# EAGLE design ESPExtra-0.1.1 (EAGLE 7.7.0)
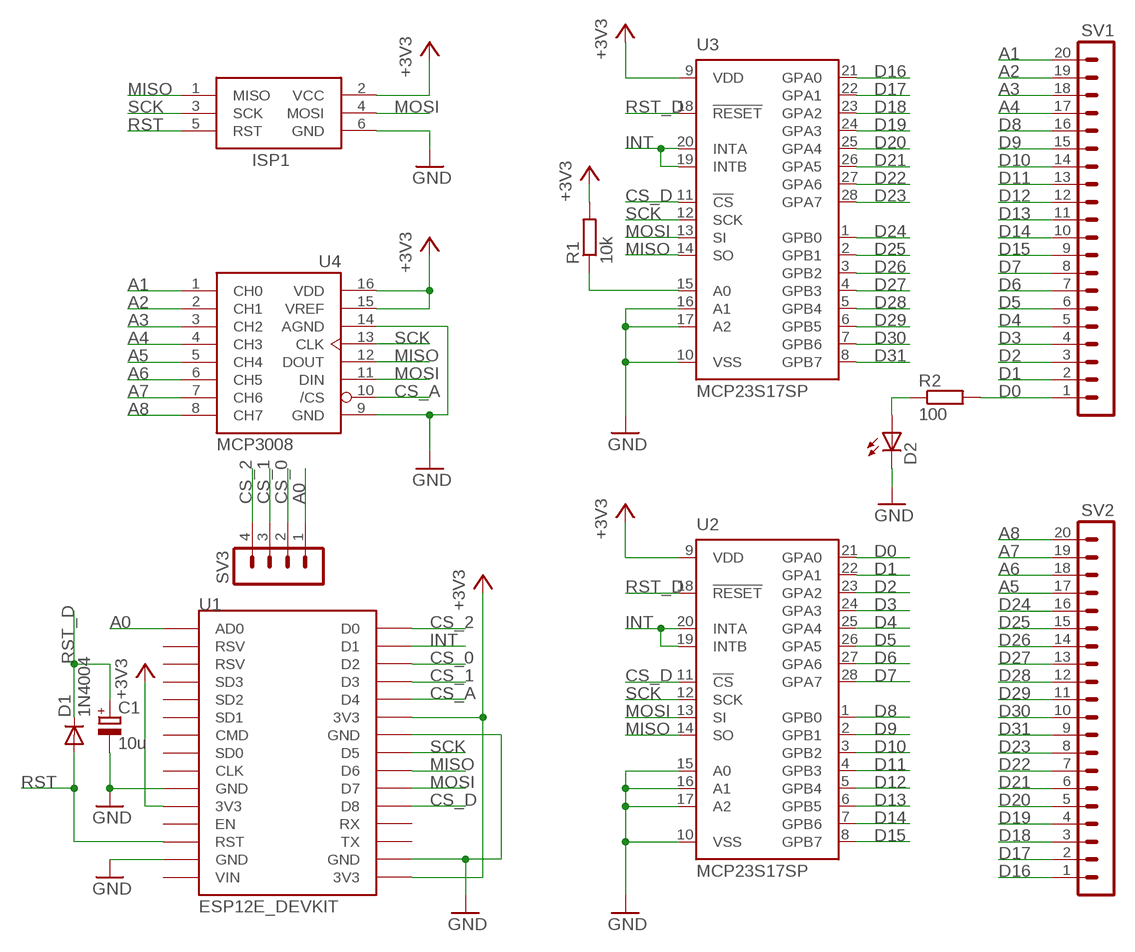
[diagram p0: schematic, sheet 1]

## Parts
C1  10u  CPOL-EUE2.5-5  [E2,5-5]
D1  1N4004  [DO41-10]
D2  LED3MM  [LED3MM]
ISP1  AVRISP-6  [AVRISP]
R1  10k  R-EU_0204/5  [0204/5]
R2  100  R-EU_0204/5  [0204/5]
SV1  MA20-1  [MA20-1]
SV2  MA20-1  [MA20-1]
SV3  MA04-1  [MA04-1]
U1  ESP12E_DEVKIT  [ESP12E_DEVKIT]
U2  MCP23S17SP  [DIL28-3]
U3  MCP23S17SP  [DIL28-3]
U4  MCP3008  [DIL16]

## Nets
+3V3: ISP1.2(VCC) R1.2 U1.3V3@0(3V3) U1.3V3@1(3V3) U1.3V3@2(3V3) U2.9(VDD) U3.9(VDD) U4.15(VREF) U4.16(VDD)
A0: SV3.1 U1.AD0
A1: SV1.20 U4.1(CH0)
A2: SV1.19 U4.2(CH1)
A3: SV1.18 U4.3(CH2)
A4: SV1.17 U4.4(CH3)
A5: SV2.17 U4.5(CH4)
A6: SV2.18 U4.6(CH5)
A7: SV2.19 U4.7(CH6)
A8: SV2.20 U4.8(CH7)
CS_0: SV3.2 U1.D2
CS_1: SV3.3 U1.D3
CS_2: SV3.4 U1.D0
CS_A: U1.D4 U4.10(/CS)
CS_D: U1.D8 U2.11(!CS) U3.11(!CS)
D0: R2.2 SV1.1 U2.21(GPA0)
D1: SV1.2 U2.22(GPA1)
D2: SV1.3 U2.23(GPA2)
D3: SV1.4 U2.24(GPA3)
D4: SV1.5 U2.25(GPA4)
D5: SV1.6 U2.26(GPA5)
D6: SV1.7 U2.27(GPA6)
D7: SV1.8 U2.28(GPA7)
D8: SV1.16 U2.1(GPB0)
D9: SV1.15 U2.2(GPB1)
D10: SV1.14 U2.3(GPB2)
D11: SV1.13 U2.4(GPB3)
D12: SV1.12 U2.5(GPB4)
D13: SV1.11 U2.6(GPB5)
D14: SV1.10 U2.7(GPB6)
D15: SV1.9 U2.8(GPB7)
D16: SV2.1 U3.21(GPA0)
D17: SV2.2 U3.22(GPA1)
D18: SV2.3 U3.23(GPA2)
D19: SV2.4 U3.24(GPA3)
D20: SV2.5 U3.25(GPA4)
D21: SV2.6 U3.26(GPA5)
D22: SV2.7 U3.27(GPA6)
D23: SV2.8 U3.28(GPA7)
D24: SV2.16 U3.1(GPB0)
D25: SV2.15 U3.2(GPB1)
D26: SV2.14 U3.3(GPB2)
D27: SV2.13 U3.4(GPB3)
D28: SV2.12 U3.5(GPB4)
D29: SV2.11 U3.6(GPB5)
D30: SV2.10 U3.7(GPB6)
D31: SV2.9 U3.8(GPB7)
GND: C1.- D2.K(C) ISP1.6(GND) U1.GND@0(GND) U1.GND@1(GND) U1.GND@2(GND) U1.GND@3(GND) U2.10(VSS) U2.15(A0) U2.16(A1) U2.17(A2) U3.10(VSS) U3.16(A1) U3.17(A2) U4.9(GND) U4.14(AGND)
INT: U1.D1 U2.19(INTB) U2.20(INTA) U3.19(INTB) U3.20(INTA)
MISO: ISP1.1(MISO) U1.D6 U2.14(SO) U3.14(SO) U4.12(DOUT)
MOSI: ISP1.4(MOSI) U1.D7 U2.13(SI) U3.13(SI) U4.11(DIN)
N$1: D2.A R2.1
N$25: R1.1 U3.15(A0)
RST: D1.A ISP1.5(RST) U1.RST
RST_D: C1.+ D1.C U2.18(!RESET) U3.18(!RESET)
SCK: ISP1.3(SCK) U1.D5 U2.12(SCK) U3.12(SCK) U4.13(CLK)
Unconnected: U1.CLK U1.CMD U1.EN U1.RSV@0(RSV) U1.RSV@1(RSV) U1.RX U1.SD0 U1.SD1 U1.SD2 U1.SD3 U1.TX U1.VIN

## Library data of the parts
C1 = resistor:CPOL-EU: POLARIZED CAPACITOR, European symbol
D1 = diode:1N4004: DIODE general purpose rectifier, 1 A
D2 = led:LED: LED OSRAM: - CHIPLED LG R971, LG N971, LY N971, LG Q971, LY Q971, LO R971, LY R971 LH N974, LH R974 LS Q976, LO Q976, LY Q976 LO Q996 - Hyper CHIPLED LW Q18S LB Q993, LB Q99A, LB R99A - SideLED LS A670, LO A670, LY A670, LG A670, LP A670 LB A673, LV A673, LT A673, LW A673 LH A674 LY A675 LS A676, LA A676, LO A676, LY A676, LW A676 LS A679, LY A679, LG A679 - Hyper Micro SIDELED® LS Y876, LA Y876, LO Y876, LY Y876 LT Y87S - SmartLED LW L88C, LW L88S LB L89C, LB L89S, LG L890 LS L89K, LO L89K, LY L89K LS L896, LA L896, LO L896, LY L896 - TOPLED LS T670, LO T670, LY T670, LG T670, LP T670 LSG T670, LSP T670, LSY T670, LOP T670, LYG T670 LG T671, LOG T671, LSG T671 LB T673, LV T673, LT T673, LW T673 LH T674 LS T676, LA T676, LO T676, LY T676, LB T676, LH T676, LSB T676, LW T676 LB T67C, LV T67C, LT T67C, LS T67K, LO T67K, LY T67K, LW E67C LS E67B, LA E67B, LO E67B, LY E67B, LB E67C, LV E67C, LT E67C LW T67C LS T679, LY T679, LG T679 LS T770, LO T770, LY T770, LG T770, LP T770 LB T773, LV T773, LT T773, LW T773 LH T774 LS E675, LA E675, LY E675, LS T675 LS T776, LA T776, LO T776, LY T776, LB T776 LHGB T686 LT T68C, LB T68C - Hyper Mini TOPLED® LB M676 - Mini TOPLED Santana® LG M470 LS M47K, LO M47K, LY M47K Source: http://www.osram.convergy.de LUXEON: - LUMILED® LXK2-PW12-R00, LXK2-PW12-S00, LXK2-PW14-U00, LXK2-PW14-V00 LXK2-PM12-R00, LXK2-PM12-S00, LXK2-PM14-U00 LXK2-PE12-Q00, LXK2-PE12-R00, LXK2-PE12-S00, LXK2-PE14-T00, LXK2-PE14-U00 LXK2-PB12-K00, LXK2-PB12-L00, LXK2-PB12-M00, LXK2-PB14-N00, LXK2-PB14-P00, LXK2-PB14-Q00 LXK2-PR12-L00, LXK2-PR12-M00, LXK2-PR14-Q00, LXK2-PR14-R00 LXK2-PD12-Q00, LXK2-PD12-R00, LXK2-PD12-S00 LXK2-PH12-R00, LXK2-PH12-S00 LXK2-PL12-P00, LXK2-PL12-Q00, LXK2-PL12-R00 Source: www.luxeon.com KINGBRIGHT: KA-3528ASYC Source: www.kingbright.com
ISP1 = adafruit:AVRISP: AVR ISP HEADER Standard 6 pin header for AVR programming
R1 R2 = resistor:R-EU_: RESISTOR, European symbol
SV1 SV2 = con-lstb:MA20-1: PIN HEADER; OC_FARNELL: unknown; OC_NEWARK: unknown
SV3 = con-lstb:MA04-1: PIN HEADER; OC_FARNELL: unknown; OC_NEWARK: unknown
U1 = ESP12E_DEVKIT:ESP12E_DEVKIT: ESP12E DEVKIT BOARD
U2 U3 = microchip:MCP23S17: http://ww1.microchip.com/downloads/en/DeviceDoc/21952a.pdf Source: http://ww1.microchip.com/downloads/en/DeviceDoc/21952a.pdf; MF: MICROCHIP; MPN: MCP23S17-E/SP; OC_FARNELL: 1292238; OC_NEWARK: 31K2951
U4 = adafruit:MCP3008

## Board
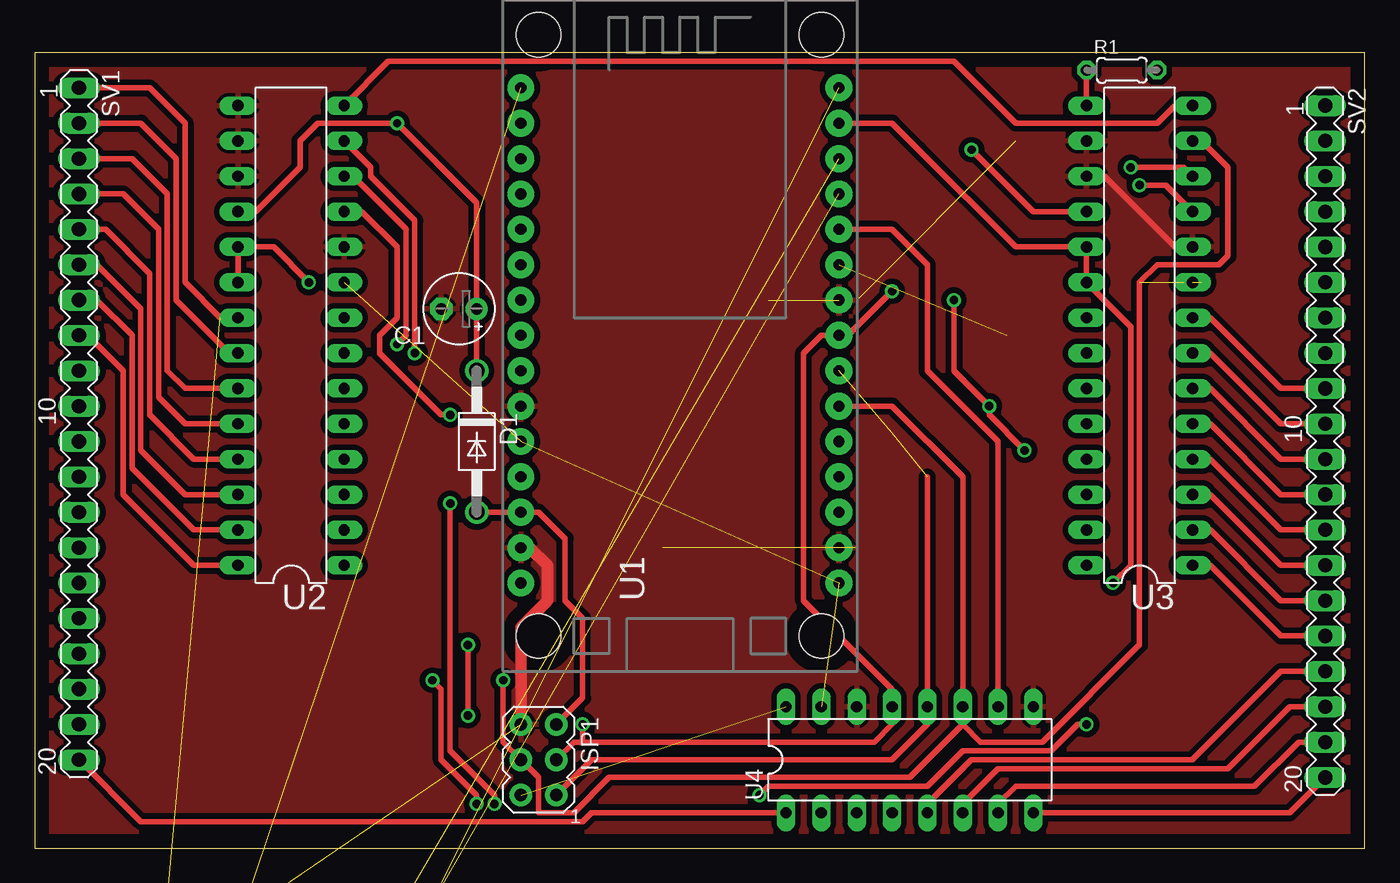
[diagram p1: board, top side]
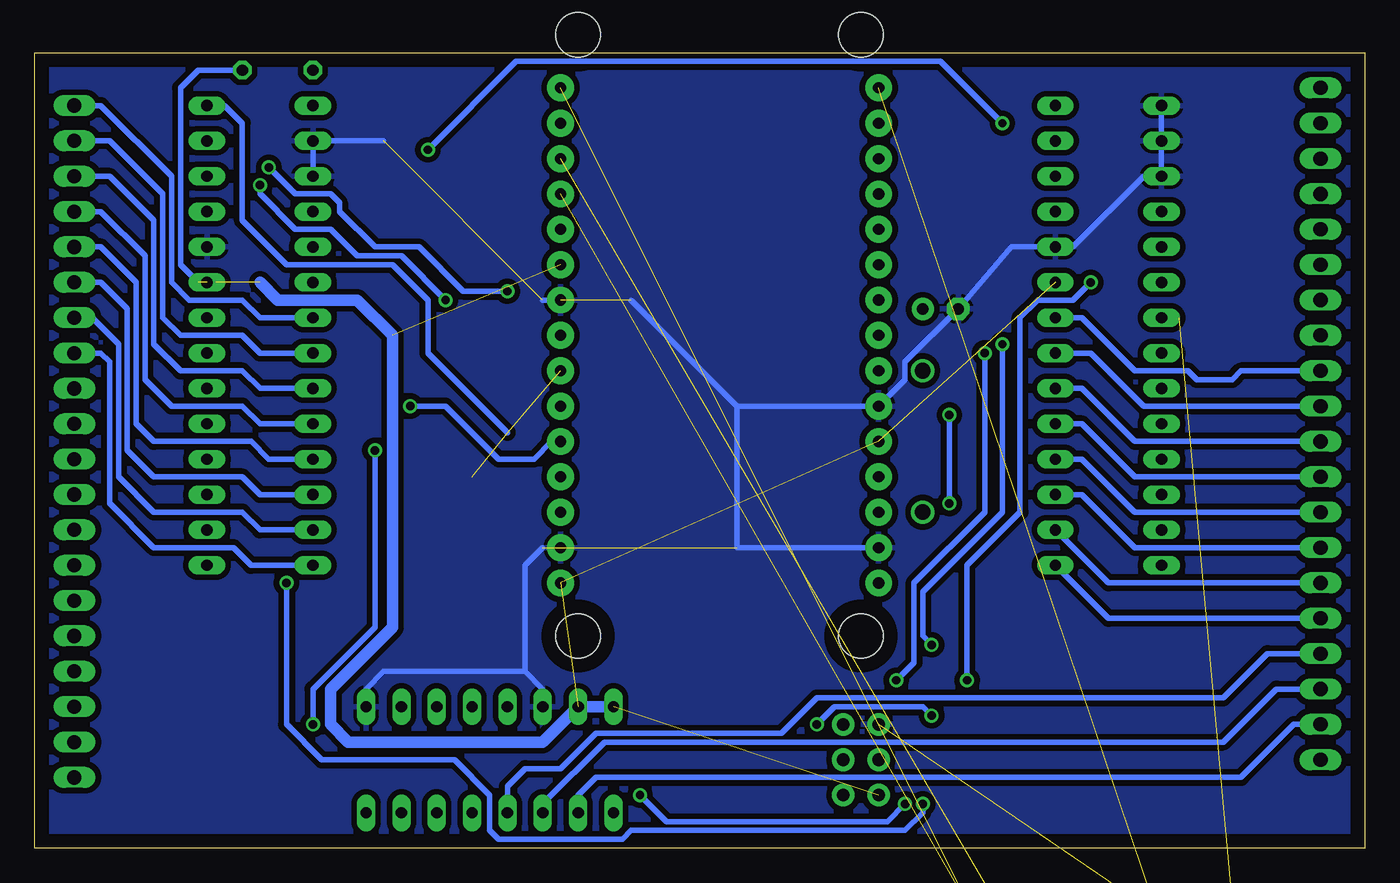
[diagram p2: board, bottom side, seen from below]

Size 95.56 x 57.14 mm. Coordinates in mm from the lower left corner, seen from the top.
Outline: 0,0 95.56,0 95.56,57.14 0,57.14 0,0
Copper layers (1*16): Top 0.035mm / dielectric 1.5mm / Bottom 0.035mm
Design rules "default": minimum track width 10mil, minimum drill 24mil, track to track 8mil, track to pad 8mil, pad to pad 8mil, via to via 8mil, smd to smd 8mil, copper to edge 40mil, drill to drill 8mil, minimum pad ring 10mil, minimum via ring 8mil, stop-mask expansion 4mil, vias tented up to drill 0mil, thermal gap 10mil

### Footprints (pad centres in the part's own frame; a part is rotated, then mirrored left to right if it is on the bottom)
E2,5-5 = drill 0.813 pad 1.6: + -1.27,0 | drill 0.813 pad 1.6 octagon: - 1.27,0
DO41-10 = drill 1.118: A 5.08,0; C -5.08,0
LED3MM = drill 0.813 octagon: A -1.27,0; K 1.27,0
AVRISP = drill 0.9 pad 1.626: 1 -1.27,2.54; 2 1.27,2.54; 3 -1.27,0; 4 1.27,0; 5 -1.27,-2.54; 6 1.27,-2.54
0204/5 = drill 0.813 octagon: 1 -2.54,0; 2 2.54,0
MA20-1 = drill 1.016 long: 1 -24.13,0; 2 -21.59,0; 3 -19.05,0; 4 -16.51,0; 5 -13.97,0; 6 -11.43,0; 7 -8.89,0; 8 -6.35,0; 9 -3.81,0; 10 -1.27,0; 11 1.27,0; 12 3.81,0; 13 6.35,0; 14 8.89,0; 15 11.43,0; 16 13.97,0; 17 16.51,0; 18 19.05,0; 19 21.59,0; 20 24.13,0
MA04-1 = drill 1.016 long: 1 -3.81,0; 2 -1.27,0; 3 1.27,0; 4 3.81,0
ESP12E_DEVKIT = drill 0.8 pad 1.93: 3V3@0 -11.43,-7.62; 3V3@1 11.43,5.08; 3V3@2 11.43,-17.78; AD0 -11.43,17.78; CLK -11.43,-2.54; CMD -11.43,2.54; D0 11.43,17.78; D1 11.43,15.24; D2 11.43,12.7; D3 11.43,10.16; D4 11.43,7.62; D5 11.43,0; D6 11.43,-2.54; D7 11.43,-5.08; D8 11.43,-7.62; EN -11.43,-10.16; GND@0 -11.43,-5.08; GND@1 -11.43,-15.24; GND@2 11.43,2.54; GND@3 11.43,-15.24; RST -11.43,-12.7; RSV@0 -11.43,15.24; RSV@1 -11.43,12.7; RX 11.43,-10.16; SD0 -11.43,0; SD1 -11.43,5.08; SD2 -11.43,7.62; SD3 -11.43,10.16; TX 11.43,-12.7; VIN -11.43,-17.78 | hole 3.2: -10.16,21.59; 10.16,21.59; 10.16,-21.59; -10.16,-21.59
DIL28-3 = drill 0.813 long: 1 -16.51,-3.81; 2 -13.97,-3.81; 3 -11.43,-3.81; 4 -8.89,-3.81; 5 -6.35,-3.81; 6 -3.81,-3.81; 7 -1.27,-3.81; 8 1.27,-3.81; 9 3.81,-3.81; 10 6.35,-3.81; 11 8.89,-3.81; 12 11.43,-3.81; 13 13.97,-3.81; 14 16.51,-3.81; 15 16.51,3.81; 16 13.97,3.81; 17 11.43,3.81; 18 8.89,3.81; 19 6.35,3.81; 20 3.81,3.81; 21 1.27,3.81; 22 -1.27,3.81; 23 -3.81,3.81; 24 -6.35,3.81; 25 -8.89,3.81; 26 -11.43,3.81; 27 -13.97,3.81; 28 -16.51,3.81
DIL16 = drill 0.813 long: 1 -8.89,-3.81; 2 -6.35,-3.81; 3 -3.81,-3.81; 4 -1.27,-3.81; 5 1.27,-3.81; 6 3.81,-3.81; 7 6.35,-3.81; 8 8.89,-3.81; 9 8.89,3.81; 10 6.35,3.81; 11 3.81,3.81; 12 1.27,3.81; 13 -1.27,3.81; 14 -3.81,3.81; 15 -6.35,3.81; 16 -8.89,3.81

### Placement (x,y rotation side)
C1  30.48,38.73 180 top
D1  31.75,29.21 270 top
D2  3.81,-11.43 0 top  (outside the outline)
ISP1  36.2,6.35 180 top
R1  78.11,55.88 0 top
R2  5.08,-24.77 0 top  (outside the outline)
SV1  3.17,30.48 270 top
SV2  92.71,29.21 270 top
SV3  6.99,-39.37 0 top  (outside the outline)
U1  46.35,36.83 0 top
U2  18.41,36.83 90 top
U3  79.38,36.83 90 top
U4  62.87,6.35 0 top

### Tracks (layer width: path | path; a pad name or v marks a point on that pad's centre or on a via)
+3V3  (7 unrouted)
  Top 0.406: 82.55,40.64 U3.9
  Bottom 0.406: R1.2 83.82,55.88 85.09,54.61 85.09,41.91 83.82,40.64
  Bottom 0.813: U4.16 U4.15 59.05,7.62 73.03,7.62 74.3,8.89 74.3,11.43 69.85,15.88 69.85,36.83 72.39,39.37 78.11,39.37 79.38,40.64
A0  (1 unrouted)
A1
  Top 0.406: U4.1 40.01,2.54 39.37,1.91 7.62,1.91 SV1.20
A2
  Bottom 0.406: U4.2 56.52,3.81 55.24,5.08 8.89,5.08 5.08,8.89 SV1.19
A3
  Bottom 0.406: U4.3 59.05,3.17 54.61,7.62 10.16,7.62 6.35,11.43 SV1.18
A4
  Bottom 0.406: U4.4 61.59,4.45 60.33,5.71 57.78,5.71 55.24,8.26 41.91,8.26 39.37,10.79 10.16,10.79 6.99,13.97 SV1.17
A5
  Top 0.406: U4.5 64.14,3.17 67.31,6.35 83.19,6.35 89.53,12.7 SV2.17
A6
  Top 0.406: U4.6 66.67,3.17 69.22,5.71 85.72,5.71 90.17,10.16 SV2.18
A7
  Top 0.406: U4.7 69.22,3.17 70.48,4.45 87.63,4.45 90.81,7.62 SV2.19
A8
  Top 0.406: U4.8 90.17,2.54 SV2.20
CS_0  (1 unrouted)
CS_1  (1 unrouted)
CS_2  (1 unrouted)
CS_A
  Top 0.406: U4.10 69.22,29.21 64.14,34.29 64.14,41.91 61.59,44.45 U1.D4
CS_D  (via drill 0.6)
  Top 0.406: U2.11 23.5,45.72 26.04,43.18 26.04,38.1 24.77,36.83 24.77,35.56 29.21,31.11 v29.84,31.11 | v29.84,24.77 29.84,6.99 33.02,3.81 v33.02,3.17 | v52.07,3.81 52.7,4.45 64.14,4.45 66.67,6.99 73.03,6.99 74.93,8.89 v75.56,8.89 | v71.12,28.57 68.58,31.11 v68.58,31.75 66.04,34.29 v66.04,39.37 | v79.38,47.62 81.28,47.62 U3.11
  Bottom 0.406: v29.84,24.77 v29.84,31.11 | v33.02,3.17 34.29,1.91 50.16,1.91 v52.07,3.81 | v75.56,8.89 75.56,11.43 71.12,15.88 v71.12,28.57 | v68.58,31.75 66.04,31.75 62.23,27.94 59.69,27.94 58.42,29.21 U1.D8 | v66.04,39.37 69.22,42.55 72.39,42.55 74.3,44.45 76.83,44.45 79.38,46.99 v79.38,47.62
D0  (1 unrouted)
  Top 0.406: SV1.1 8.26,54.61 10.79,52.07 10.79,40.64 13.34,38.1 U2.21
D1
  Top 0.406: SV1.2 7.62,52.07 10.16,49.53 10.16,39.37 13.97,35.56 U2.22
D2
  Top 0.406: SV1.3 6.99,49.53 9.53,46.99 9.53,34.29 10.79,33.02 U2.23
D3
  Top 0.406: SV1.4 6.35,46.99 8.89,44.45 8.89,32.38 10.79,30.48 U2.24
D4
  Top 0.406: SV1.5 5.08,44.45 8.26,41.27 8.26,31.11 11.43,27.94 U2.25
D5
  Top 0.406: SV1.6 4.45,41.91 7.62,38.73 7.62,28.57 10.79,25.4 U2.26
D6
  Top 0.406: SV1.7 4.45,39.37 6.99,36.83 6.99,27.3 11.43,22.86 U2.27
D7
  Top 0.406: SV1.8 3.81,36.83 6.35,34.29 6.35,25.4 11.43,20.32 U2.28
D8
  Bottom 0.406: SV1.16 18.41,16.51 U2.1
D9
  Bottom 0.406: SV1.15 18.41,19.05 U2.2
D10
  Bottom 0.406: SV1.14 16.51,21.59 20.32,25.4 U2.3
D11
  Bottom 0.406: SV1.13 16.51,24.13 20.32,27.94 U2.4
D12
  Bottom 0.406: SV1.12 16.51,26.67 20.32,30.48 U2.5
D13
  Bottom 0.406: SV1.11 16.51,29.21 20.32,33.02 U2.6
D14
  Bottom 0.406: SV1.10 15.88,31.75 19.68,35.56 U2.7
D15
  Bottom 0.406: SV1.9 8.89,34.29 9.53,33.66 12.06,33.66 12.7,34.29 16.51,34.29 20.32,38.1 U2.8
D16
  Bottom 0.406: U3.21 79.38,38.1 80.64,39.37 84.45,39.37 85.72,40.64 85.72,48.26 90.81,53.34 SV2.1
D17
  Bottom 0.406: U3.22 79.38,35.56 80.64,36.83 85.09,36.83 86.36,38.1 86.36,46.99 90.17,50.8 SV2.2
D18
  Bottom 0.406: U3.23 79.38,33.02 80.64,34.29 85.09,34.29 87,36.2 87,45.09 90.17,48.26 SV2.3
D19
  Bottom 0.406: U3.24 79.38,30.48 80.64,31.75 85.72,31.75 87.63,33.66 87.63,42.55 90.81,45.72 SV2.4
D20
  Bottom 0.406: U3.25 78.74,27.94 80.01,29.21 87,29.21 88.27,30.48 88.27,40.64 90.81,43.18 SV2.5
D21
  Bottom 0.406: U3.26 79.38,25.4 80.64,26.67 87,26.67 88.9,28.57 88.9,38.73 90.81,40.64 SV2.6
D22
  Bottom 0.406: U3.27 79.38,22.86 80.64,24.13 87,24.13 89.53,26.67 89.53,36.2 91.44,38.1 SV2.7
D23
  Bottom 0.406: U3.28 80.01,20.32 81.28,21.59 87,21.59 90.17,24.77 90.17,34.92 90.81,35.56 SV2.8
D24
  Top 0.406: U3.1 84.45,20.32 89.53,15.24 SV2.16
D25
  Top 0.406: U3.2 84.45,22.86 89.53,17.78 SV2.15
D26
  Top 0.406: U3.3 84.45,25.4 89.53,20.32 SV2.14
D27
  Top 0.406: U3.4 84.45,27.94 89.53,22.86 SV2.13
D28
  Top 0.406: U3.5 84.45,30.48 89.53,25.4 SV2.12
D29
  Top 0.406: U3.6 84.45,33.02 89.53,27.94 SV2.11
D30
  Top 0.406: U3.7 84.45,35.56 89.53,30.48 SV2.10
D31
  Top 0.406: U3.8 84.45,38.1 89.53,33.02 SV2.9
GND  (5 unrouted)
  Top 0.406: U3.17 76.83,48.26 81.92,43.18 U3.10
  Top 0.813: ISP1.6 34.92,15.88 36.83,17.78 36.83,20.32 35.56,21.59 U1.GND@1
  Bottom 0.406: U2.15 U2.16 U2.17 15.88,48.26 20.95,43.18 U2.10 25.4,43.18 C1.- 33.02,34.92 33.02,33.66 U1.GND@0 45.09,31.75 | U3.17 U3.16 70.48,50.8 | U4.9 71.75,11.43 70.48,12.7 60.33,12.7 | 60.33,12.7 59.05,11.43 U4.14 | U1.GND@1 45.09,21.59 45.09,31.75 | 45.09,31.75 52.7,39.37 | 59.05,21.59 60.33,20.32 60.33,12.7 | U1.GND@2 59.05,39.37
  pour Top (isolate 0.406): 0,57.15 0,0 95.89,0 95.89,57.15
  pour Bottom (isolate 0.406): 0,57.15 0,0 95.89,0 95.89,57.15
INT  (via drill 0.6)
  Top 0.406: U2.20 U2.19 17.14,43.18 v19.68,40.64 | U1.D1 61.59,52.07 63.5,50.16 70.48,43.18 U3.19 U3.20 78.74,37.47 78.74,20.32 v77.47,19.05 | v28.57,12.06 29.21,11.43 29.21,6.35 31.75,3.81 v31.75,3.17
  Bottom 0.406: v19.68,40.64 20.95,39.37 23.5,39.37 24.77,38.1 24.77,24.13 28.57,20.32 v28.57,12.06 | v31.75,3.17 31.75,2.54 33.02,1.27 52.7,1.27 53.34,0.64 62.23,0.64 62.87,1.27 62.87,3.81 65.41,6.35 74.93,6.35 77.47,8.89 v77.47,19.05
MISO  (2 unrouted)
  Top 0.406: 64.14,26.67 U4.12 64.14,8.89 61.59,6.35 40.01,6.35 ISP1.1 | U3.14 81.92,53.34 80.64,52.07 70.48,52.07 66.04,56.52 25.4,56.52 U2.14
  Bottom 0.406: 61.59,29.84 67.31,35.56 67.31,39.37 69.85,41.91 77.47,41.91 80.64,45.09 80.64,52.07 81.92,53.34 U3.14
MOSI  (via drill 0.6)
  Top 0.406: U1.D7 61.59,31.75 66.67,26.67 U4.11 66.67,8.89 | 66.67,8.89 62.87,5.08 41.27,5.08 38.73,2.54 36.2,2.54 36.2,5.08 ISP1.4 33.66,7.62 v33.66,12.06 | U3.13 83.82,50.8 85.72,48.9 85.72,42.55 85.09,41.91 80.64,41.91 79.38,40.64 79.38,14.61 72.39,7.62 67.94,7.62 66.67,8.89 | U2.13 24.13,48.9 24.13,48.26 27.3,45.09 v27.3,35.56
  Bottom 0.406: v27.3,35.56 27.3,24.13 32.38,19.05 32.38,13.34 v33.66,12.06
N$1  (1 unrouted)
N$25
  Top 0.406: U3.15 R1.1
RST
  Top 0.406: ISP1.5 39.37,10.79 39.37,16.51 38.1,17.78 38.1,22.23 36.2,24.13 U1.RST D1.A
RST_D  (via drill 0.6)
  Top 0.406: U2.18 15.88,45.72 19.05,48.9 19.05,50.8 20.32,52.07 v26.04,52.07 31.75,46.35 C1.+ D1.C | v67.31,50.16 71.75,45.72 U3.18
  Bottom 0.406: v67.31,50.16 60.96,56.52 30.48,56.52 v26.04,52.07
SCK  (via drill 0.6)
  Top 0.406: 39.37,7.62 60.33,7.62 61.59,8.89 U4.13 61.59,11.43 55.24,17.78 55.24,35.56 56.52,36.83 U1.D5 58.42,36.83 v61.59,40.01 | 39.37,7.62 38.73,7.62 ISP1.3 | U2.12 22.86,48.26 26.67,44.45 26.67,36.83 v26.04,36.2 | v31.11,9.53 v31.11,14.61 | 39.37,7.62 v39.37,8.89 | v78.74,48.9 82.55,48.9 U3.12
  Bottom 0.406: v26.04,36.2 26.04,24.13 31.75,18.41 31.75,15.24 v31.11,14.61 | v31.11,9.53 31.75,10.16 38.1,10.16 v39.37,8.89 | v61.59,40.01 64.77,40.01 67.94,43.18 71.12,43.18 73.66,45.72 73.66,46.35 74.3,46.99 76.83,46.99 v78.74,48.9